# Altium schematic sheet PFC-120W.SchDoc
size A4
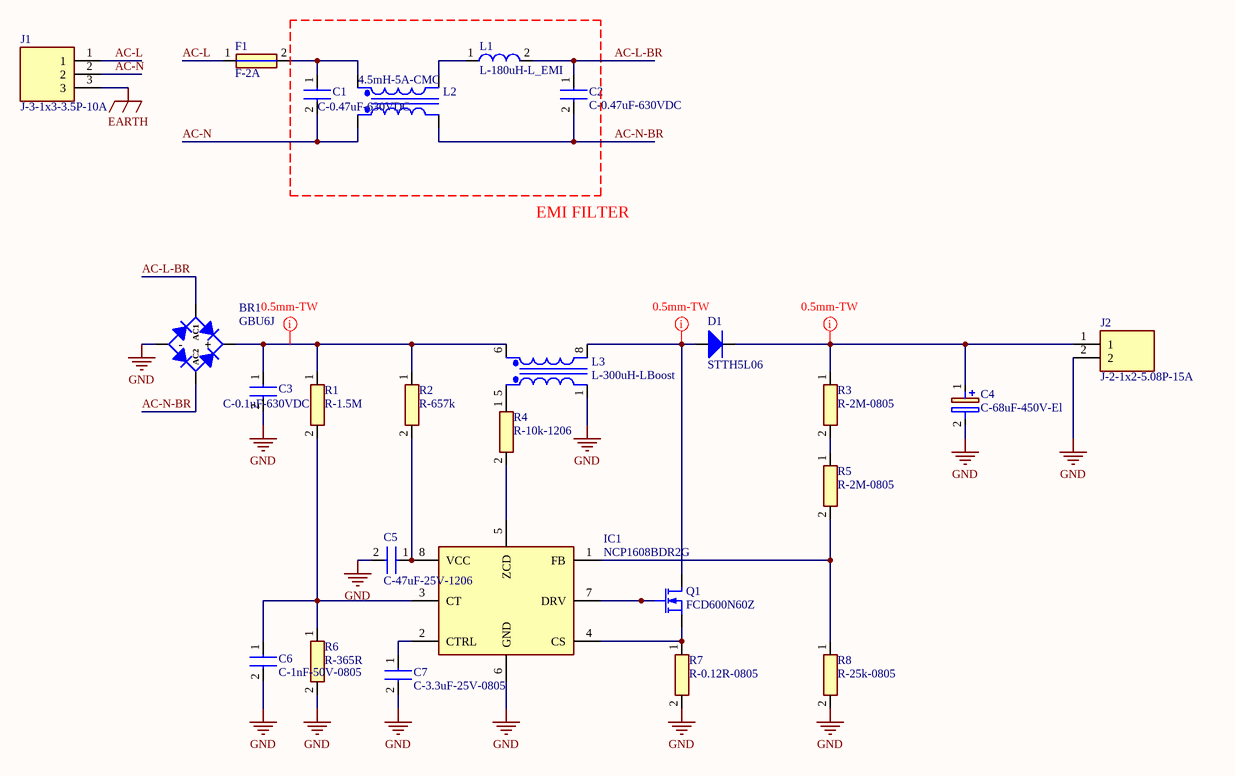
[diagram p0: PFC-120W.SchDoc]

## Parts
BR1  GBU6J  [GBU6J]
C1  C-0.47uF-630VDC  [ECWFA2J474JC]
C2  C-0.47uF-630VDC  [ECWFA2J474JC]
C3  C-0.1uF-630VDC  [BFC233923104]
C4  C-68uF-450V-El  [CAPPRD750W80D1825H3750]
C5  C-47uF-25V-1206  [CAPC3216X180N]
C6  C-1nF-50V-0805  [CAPC2012X135N]
C7  C-3.3uF-25V-0805  [CAPC2012X145N]
D1  STTH5L06  [DPAK-STTH5L06]
F1  F-2A  [FUSC10131X312N]
IC1  NCP1608BDR2G  [SOIC127P600X175-8N]
J1  J-3-1x3-3.5P-10A  [691214110003]
J2  J-2-1x2-5.08P-15A  [RHDR2W90P0X508_1X2_1066X810X1000P]
L1  L-180uH-L_EMI  [AIRD03181K]
L2  4.5mH-5A-CMC  [SC05E45JH]
L3  L-300uH-LBoost  [L-300uH-LBoost]
Q1  FCD600N60Z  [DPAK-FCD600N60Z]
R1  R-1.5M  [RESC3216X60N]
R2  R-657k  [0805_RES]
R3  R-2M-0805  [RESC2012X65N]
R4  R-10k-1206  [RESC3216X60N]
R5  R-2M-0805  [RESC2012X65N]
R6  R-365R  [RESC2012X65N]
R7  R-0.12R-0805  [RESC2012X60N]
R8  R-25k-0805  [RESC2012X65N]

## Nets
EARTH: J1.3
GND: BR1.4(-) C3.2 C4.2(-) C5.2 C6.2 C7.2 IC1.6(GND) J2.2 L3.1 R6.2 R7.2 R8.2
AC-L: F1.1 J1.1
AC-L-BR: BR1.2(AC1) C2.1 L1.2
AC-N: C1.2 J1.2 L2.3
AC-N-BR: BR1.3(AC2) C2.2 L2.4
NetBR1_1: BR1.1(+) C3.1 L3.6 R1.1 R2.1
NetC1_1: C1.1 F1.2 L2.1
NetC4_1: C4.1(+) D1.K J2.1 R3.1
NetC5_1: C5.1 IC1.8(VCC) R2.2
NetC6_1: C6.1 IC1.3(CT) R1.2 R6.1
NetC7_1: C7.1 IC1.2(CTRL)
NetD1_A: D1.A L3.8 Q1.D
NetIC1_1: IC1.1(FB) R5.2 R8.1
NetIC1_4: IC1.4(CS) Q1.S R7.1
NetIC1_5: IC1.5(ZCD) R4.2
NetIC1_7: IC1.7(DRV) Q1.G
NetL1_1: L1.1 L2.2
NetL3_5: L3.5 R4.1
NetR3_2: R3.2 R5.1

## Layout directives
Trace Width: 0.5mm; rule Width Constraint [Pref Width = 0.5mm    Min Width = 0.5mm    Max Width = 0.5mm]: NetBR1_1, NetC4_1, NetD1_A

## Notes on the sheet
- EMI FILTER

## Library data of the parts
BR1 = GBU6J: Bridge Rectifier; Manufacturer_Name: GeneSiC Semiconductor; Datasheet Link: https://www.diodemodule.com/silicon_products/bridge_rectifiers/gbu6j.pdf; Height: 18.8mm; Manufacturer_Part_Number: GBU6J; Arrow Part Number: GBU6J; Arrow Price/Stock: https://www.arrow.com/en/products/gbu6j/genesic-semiconductor; Mouser Part Number: 905-GBU6J; Mouser Price/Stock: https://www.mouser.com/Search/Refine.aspx?Keyword=905-GBU6J
C1 C2 = C-0.47uF-630VDC: Capacitor; Manufacturer_Name: Panasonic; Manufacturer_Part_Number: ECW-FA2J474JC; Datasheet Link: https://industrial.panasonic.com/cdbs/www-data/pdf/RDI0000/ABD0000C183.pdf; Height: 16.6mm; Arrow Part Number: ECW-FA2J474JC; Mouser Part Number: N/A; Mouser Price/Stock: https://www.mouser.com/Search/Refine.aspx?Keyword=N%2FA
C3 = C-0.1uF-630VDC: Capacitor; Manufacturer_Name: Vishay; Datasheet Link: https://www.vishay.com/docs/28138/mkp339x2.pdf; Height: 11mm; Manufacturer_Part_Number: BFC233923104; Arrow Part Number: BFC233923104; Arrow Price/Stock: https://www.arrow.com/en/products/bfc233923104/vishay; Mouser Part Number: 594-2222-339-23104; Mouser Price/Stock: https://www.mouser.co.uk/ProductDetail/Vishay-BC-Components/BFC233923104?qs=ISnuAD7LFbI3phV4%252BcMAWg%3D%3D
C4 = C-68uF-450V-El: Capacitor Polarised; Manufacturer_Name: Nichicon; Manufacturer_Part_Number: UVY2W680MHD; Datasheet Link: https://www.mouser.in/datasheet/2/293/e-uvy-1315204.pdf; Height: 37.5mm; Arrow Part Number: UVY2W680MHD
C5 = C-47uF-25V-1206: Capacitor; Manufacturer_Name: TDK; Manufacturer_Part_Number: C3216X5R1E476M160AC; Datasheet Link: https://product.tdk.com/info/en/catalog/datasheets/mlcc_commercial_midvoltage_en.pdf; Height: 1.8mm; Arrow Part Number: C3216X5R1E476M160AC; Arrow Price/Stock: https://www.arrow.com/en/products/c3216x5r1e476m160ac/tdk; Mouser Part Number: 810-C3216X5R1E476M; Mouser Price/Stock: https://www.mouser.co.uk/ProductDetail/TDK/C3216X5R1E476M160AC?qs=NRhsANhppD%252BqapdVvBvu4Q%3D%3D
C6 = C-1nF-50V-0805: Capacitor; Manufacturer_Name: Wurth Elektronik; Manufacturer_Part_Number: 885382207004; Datasheet Link: https://katalog.we-online.com/pbs/datasheet/885382207004.pdf; Height: 1.35mm; Arrow Part Number: 885382207004; Mouser Part Number: 710-885382207004; Mouser Price/Stock: https://www.mouser.co.uk/ProductDetail/Wurth-Elektronik/885382207004?qs=0lSvoLzn4L%2FZU7nl%252BtmUHg%3D%3D
C7 = C-3.3uF-25V-0805: Capacitor; Manufacturer_Name: TDK; Manufacturer_Part_Number: C2012X7R1E335M125AB; Datasheet Link: https://product.tdk.com/info/en/catalog/datasheets/mlcc_commercial_midvoltage_en.pdf; Height: 1.45mm; Arrow Part Number: C2012X7R1E335M125AB; Mouser Part Number: 810-C2012X7R1E335M; Mouser Price/Stock: https://www.mouser.com/Search/Refine.aspx?Keyword=810-C2012X7R1E335M
D1 = STTH5L06: Diode; Manufacturer: STMicroelectronics; Manufacturer Part Number: STTH5L06FP
F1 = F-2A: Fuse; Manufacturer_Name: LITTELFUSE; Manufacturer_Part_Number: 0461002.ERT; Datasheet Link: https://www.littelfuse.com/~/media/electronics/datasheets/fuses/littelfuse_fuse_461_datasheet.pdf.pdf; Height: 3.12mm; Arrow Part Number: 0461002.ERT; Mouser Part Number: 576-0461002.ERT; Mouser Price/Stock: https://www.mouser.com/Search/Refine.aspx?Keyword=576-0461002.ERT
IC1 = NCP1608BDR2G: Integrated Circuit; Manufacturer_Name: ON Semiconductor; Datasheet Link: http://www.onsemi.com/pub/Collateral/NCP1608-D.PDF; Height: 1.75mm; Manufacturer_Part_Number: NCP1608BDR2G; Arrow Part Number: NCP1608BDR2G; Arrow Price/Stock: https://www.arrow.com/en/products/ncp1608bdr2g/on-semiconductor; Mouser Part Number: 863-NCP1608BDR2G; Mouser Price/Stock: https://www.mouser.co.uk/ProductDetail/ON-Semiconductor/NCP1608BDR2G?qs=lYuAOLy5nvYEkEt6P%2FPS%2FA%3D%3D
J1 = J-3-1x3-3.5P-10A: Connector; Manufacturer_Name: Wurth Elektronik; Datasheet Link: https://katalog.we-online.de/em/datasheet/6912141100xx.pdf; Height: 8.5mm; Manufacturer_Part_Number: 691214110003; Arrow Part Number: 691214110003; Mouser Part Number: 710-691214110003; Mouser Price/Stock: https://www.mouser.co.uk/ProductDetail/Wurth-Elektronik/691214110003?qs=7gQLVZk5cPlrsv0RXQNEtw%3D%3D
J2 = J-2-1x2-5.08P-15A: Connector; Manufacturer_Name: On-Shore Technology; Manufacturer_Part_Number: EDZ250/2; Datasheet Link: https://media.digikey.com/pdf/Data%20Sheets/On%20Shore%20PDFs/EDZ250.pdf; Height: 10mm; Arrow Part Number: EDZ250/2; Arrow Price/Stock: https://www.arrow.com/en/products/edz2502/on-shore-technology
L1 = L-180uH-L_EMI: Inductor; Manufacturer_Name: ABRACON; Manufacturer_Part_Number: AIRD-03-181K; Datasheet Link: https://abracon.com/Magnetics/radial/AIRD03.pdf; Height: 21mm; Arrow Part Number: AIRD-03-181K; Mouser Part Number: 815-AIRD-03-181K; Mouser Price/Stock: https://www.mouser.com/Search/Refine.aspx?Keyword=815-AIRD-03-181K
L2 = 4.5mH-5A-CMC: Filter; Manufacturer_Name: Kemet; Manufacturer_Part_Number: SC-05-E45JH; Datasheet Link: https://www.mouser.ca/datasheet/2/212/1/KEM_LF0010_SC-JH-1104039.pdf; Height: 21mm; Arrow Part Number: SC-05-E45JH; Mouser Part Number: 80-SC-05-E45JH; Mouser Price/Stock: https://www.mouser.co.uk/ProductDetail/KEMET/SC-05-E45JH?qs=PzGy0jfpSMt0Gme%2FtVncCQ%3D%3D
L3 = L-300uH-LBoost: Inductor; Manufacturer Part Number: PFC3125ER-301K05B-00; Manufacturer: TDK Corporation
Q1 = FCD600N60Z: N-Mosfet; Manufacturer: ON Semiconductor; Datasheet: https://www.onsemi.com/pub/Collateral/FCD600N60Z-D.pdf; Manufacturer Part Number: FCD600N60Z
R1 = R-1.5M: Resistor; Manufacturer_Name: Vishay; Manufacturer_Part_Number: CRCW12061M50FKEA; Datasheet Link: http://www.vishay.com/docs/20035/dcrcwe3.pdf; Height: 0.6mm; Arrow Part Number: CRCW12061M50FKEA; Mouser Part Number: 71-CRCW1206-1.5M-E3; Mouser Price/Stock: https://www.mouser.com/Search/Refine.aspx?Keyword=71-CRCW1206-1.5M-E3
R2 = R-657k: Resistor; Manufacturer Part Number: RN73R2ATTD6573D25; Manufacturer: KOA Speer Electronics, Inc.
R3 R5 = R-2M-0805: Resistor; Manufacturer_Name: TE Connectivity; Manufacturer_Part_Number: CPF0805B2M0E; Datasheet Link: http://docs-europe.electrocomponents.com/webdocs/13d1/0900766b813d116f.pdf; Height: 0.65mm; Arrow Part Number: CPF0805B2M0E; Arrow Price/Stock: https://www.arrow.com/en/products/cpf0805b2m0e/te-connectivity; Mouser Part Number: 279-CPF0805B2M0E
R4 = R-10k-1206: Resistor; Manufacturer_Name: Vishay; Manufacturer_Part_Number: CRCW120610K0FKEB; Datasheet Link: http://componentsearchengine.com/Datasheets/1/CRCW120610K0FKEB.pdf; Height: 0.6mm; Arrow Part Number: CRCW120610K0FKEB; Arrow Price/Stock: https://www.arrow.com/en/products/crcw120610k0fkeb/vishay; Mouser Part Number: 71-CRCW120610K0FKEB; Mouser Price/Stock: https://www.mouser.com/Search/Refine.aspx?Keyword=71-CRCW120610K0FKEB
R6 = R-365R-0805: Resistor; Manufacturer_Name: TE Connectivity; Manufacturer_Part_Number: CPF0805B365RE1; Datasheet Link: http://docs-europe.electrocomponents.com/webdocs/13d1/0900766b813d116f.pdf; Height: 0.65mm; Arrow Part Number: CPF0805B365RE1; Mouser Part Number: 279-CPF0805B365RE1; Mouser Price/Stock: https://www.mouser.com/Search/Refine.aspx?Keyword=279-CPF0805B365RE1
R7 = R-0.12R-0805: Resistor; Manufacturer_Name: YAGEO (PHYCOMP); Manufacturer_Part_Number: RL0805FR-070R12L; Datasheet Link: http://componentsearchengine.com/Datasheets/1/RL0805FR-070R12L.pdf; Height: 0.6mm; Arrow Part Number: RL0805FR-070R12L; Mouser Part Number: 603-RL0805FR-070R12L; Mouser Price/Stock: https://www.mouser.co.uk/ProductDetail/Yageo/RL0805FR-070R12L?qs=BXCcY9r%252B08BjW2juGncMQg%3D%3D
R8 = R-25k-0805: Resistor; Manufacturer_Name: TE Connectivity; Manufacturer_Part_Number: CPF-A-0805B25KE1; Datasheet Link: http://docs-emea.rs-online.com/webdocs/13f1/0900766b813f17cd.pdf; Height: 0.65mm; Arrow Part Number: CPF-A-0805B25KE1; Arrow Price/Stock: https://www.arrow.com/en/products/cpf-a-0805b25ke1/te-connectivity; Mouser Part Number: 279-CPF-A-0805B25KE1; Mouser Price/Stock: https://www.mouser.com/Search/Refine.aspx?Keyword=279-CPF-A-0805B25KE1